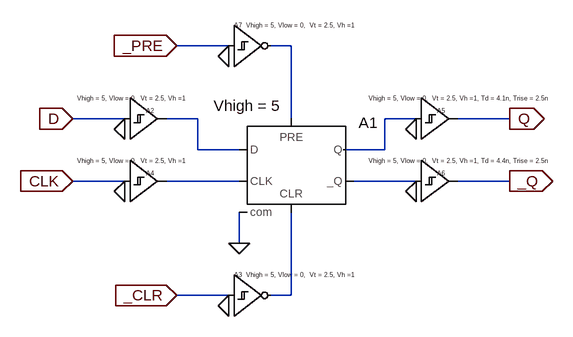
[diagram p0: schematic SN74LVC2G74DCUR.asc]
SN74LVC2G74DCUR.asc, the LTspice schematic file:
Version 4.1
SHEET 1 880 712
WIRE 32 -80 -48 -80
WIRE 128 -80 96 -80
WIRE -128 32 -208 32
WIRE -16 32 -64 32
WIRE 128 32 128 -80
WIRE 320 32 272 32
WIRE 464 32 384 32
WIRE -16 80 -16 32
WIRE 48 80 -16 80
WIRE 272 80 272 32
WIRE 272 80 208 80
WIRE -128 128 -208 128
WIRE 48 128 -64 128
WIRE 320 128 224 128
WIRE 464 128 384 128
WIRE 48 224 48 176
WIRE 32 304 -48 304
WIRE 128 304 128 176
WIRE 128 304 96 304
FLAG 48 224 0
FLAG -128 144 0
FLAG -128 48 0
FLAG 320 144 0
FLAG 320 48 0
FLAG 32 320 0
FLAG 32 -64 0
FLAG -48 -80 _PRE
IOPIN -48 -80 In
FLAG -208 32 D
IOPIN -208 32 In
FLAG -48 304 _CLR
IOPIN -48 304 In
FLAG -208 128 CLK
IOPIN -208 128 In
FLAG 464 128 _Q
IOPIN 464 128 Out
FLAG 464 32 Q
IOPIN 464 32 Out
SYMBOL Digital\\dflop 128 32 R0
WINDOW 3 -119 -20 Left 2
SYMATTR Value Vhigh = 5
SYMATTR InstName A1
SYMBOL Digital\\schmtinv 32 240 R0
WINDOW 0 8 32 Left 0
WINDOW 3 27 32 Left 0
SYMATTR InstName A3
SYMATTR Value Vhigh = 5, Vlow = 0,  Vt = 2.5, Vh =1
SYMBOL Digital\\schmtbuf -128 -32 R0
WINDOW 0 33 52 Left 0
WINDOW 3 -73 33 Left 0
SYMATTR InstName A2
SYMATTR Value Vhigh = 5, Vlow = 0,  Vt = 2.5, Vh =1
SYMBOL Digital\\schmtbuf -128 64 R0
WINDOW 0 33 52 Left 0
WINDOW 3 -73 33 Left 0
SYMATTR InstName A4
SYMATTR Value Vhigh = 5, Vlow = 0,  Vt = 2.5, Vh =1
SYMBOL Digital\\schmtbuf 320 -32 R0
WINDOW 0 33 52 Left 0
WINDOW 3 -73 33 Left 0
SYMATTR InstName A5
SYMATTR Value Vhigh = 5, Vlow = 0,  Vt = 2.5, Vh =1, Td = 4.1n, Trise = 2.5n
SYMBOL Digital\\schmtbuf 320 64 R0
WINDOW 0 33 52 Left 0
WINDOW 3 -73 33 Left 0
SYMATTR InstName A6
SYMATTR Value Vhigh = 5, Vlow = 0,  Vt = 2.5, Vh =1, Td = 4.4n, Trise = 2.5n
SYMBOL Digital\\schmtinv 32 -144 R0
WINDOW 0 8 32 Left 0
WINDOW 3 27 32 Left 0
SYMATTR InstName A7
SYMATTR Value Vhigh = 5, Vlow = 0,  Vt = 2.5, Vh =1

The netlist it stands for:
* SN74LVC2G74DCUR.asc
A1 N002 0 N004 N001 N006 N005 N003 0 DFLOP Vhigh = 5
A3 _CLR 0 0 0 0 N006 0 0 SCHMITT Vhigh = 5, Vlow = 0,  Vt = 2.5, Vh =1
A2 D 0 0 0 0 0 N002 0 SCHMITT Vhigh = 5, Vlow = 0,  Vt = 2.5, Vh =1
A4 CLK 0 0 0 0 0 N004 0 SCHMITT Vhigh = 5, Vlow = 0,  Vt = 2.5, Vh =1
A5 N003 0 0 0 0 0 Q 0 SCHMITT Vhigh = 5, Vlow = 0,  Vt = 2.5, Vh =1, Td = 4.1n, Trise = 2.5n
A6 N005 0 0 0 0 0 _Q 0 SCHMITT Vhigh = 5, Vlow = 0,  Vt = 2.5, Vh =1, Td = 4.4n, Trise = 2.5n
A7 _PRE 0 0 0 0 N001 0 0 SCHMITT Vhigh = 5, Vlow = 0,  Vt = 2.5, Vh =1
.backanno
.end